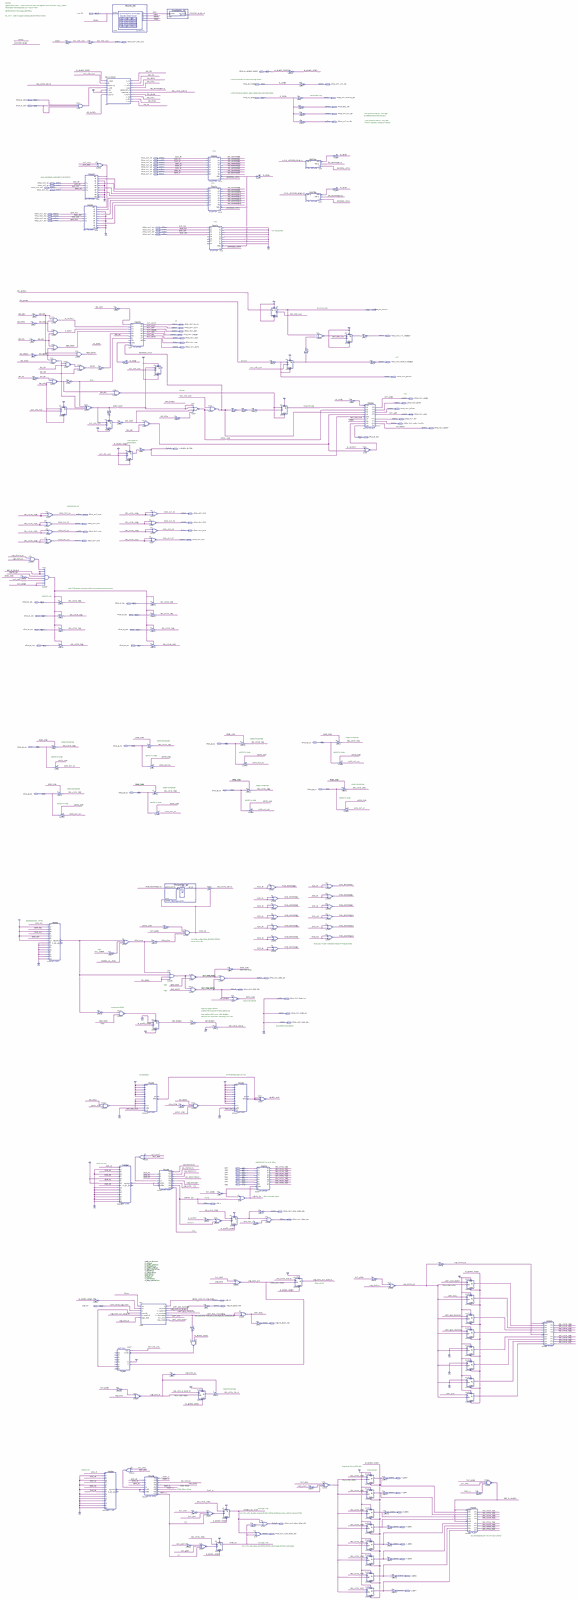
[diagram p0: schematic sheet, whole]
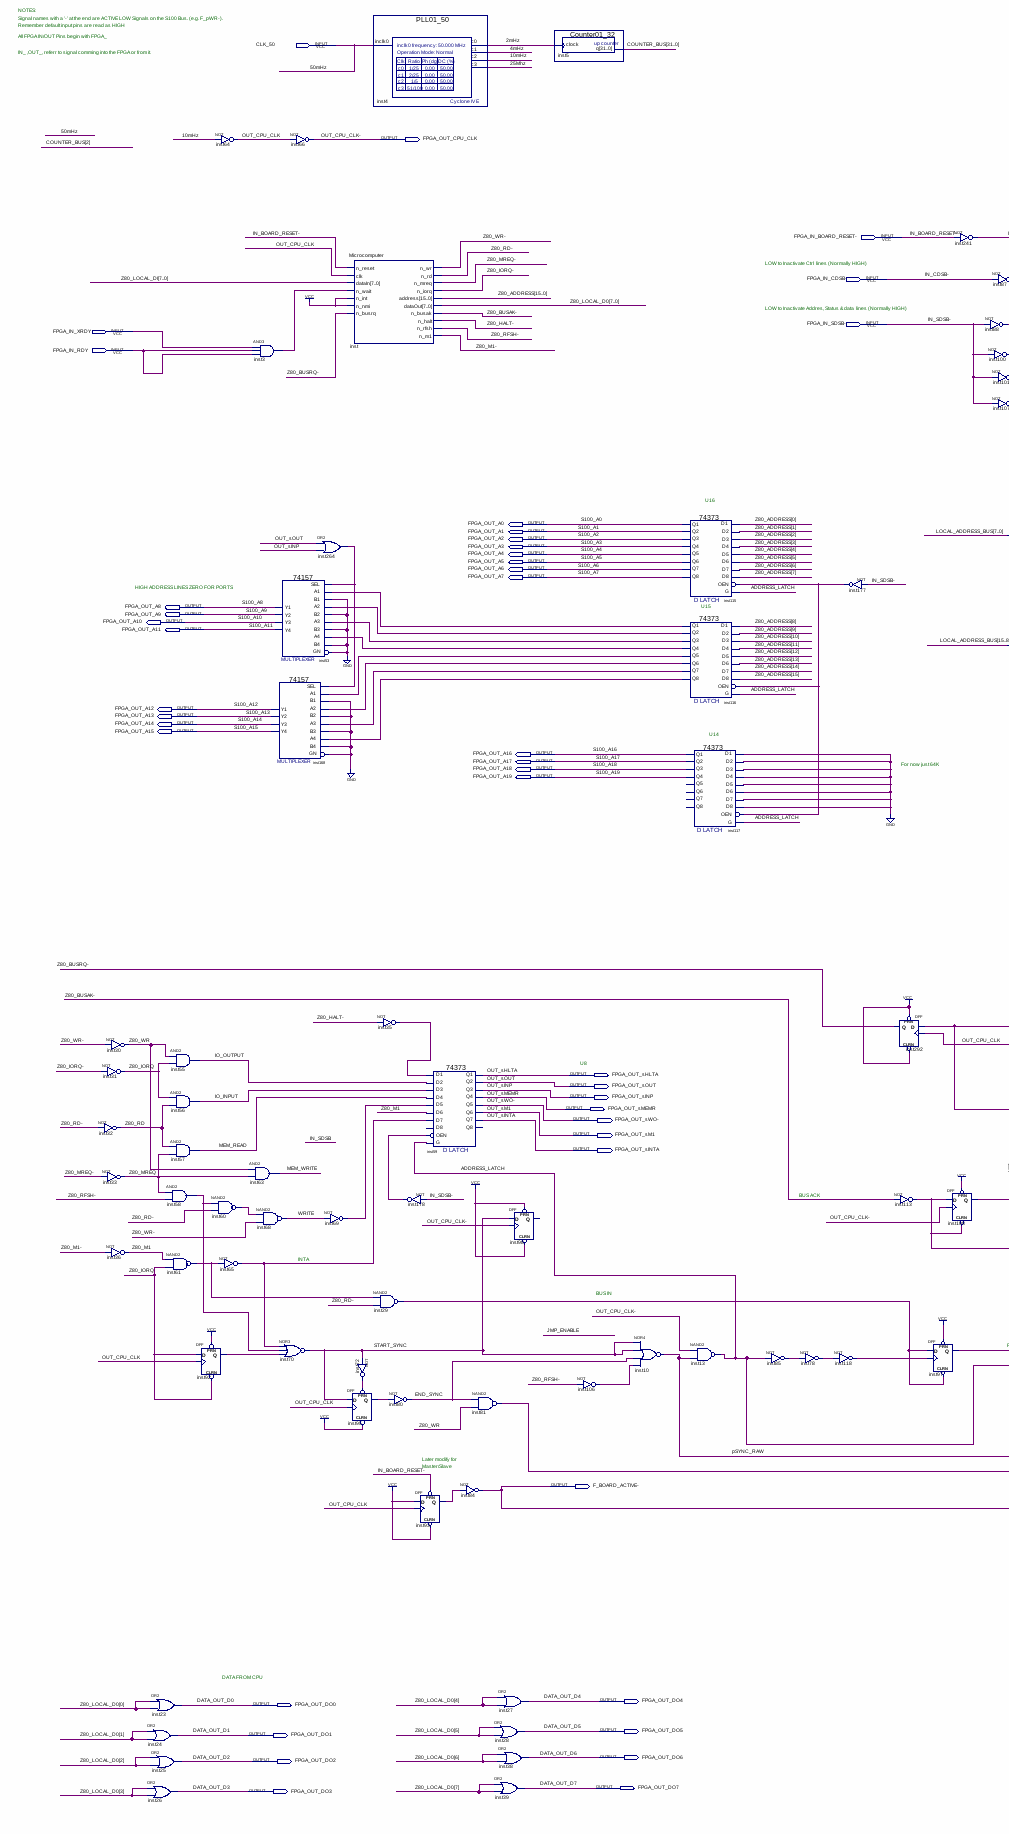
[diagram p1: schematic sheet, upper left part]
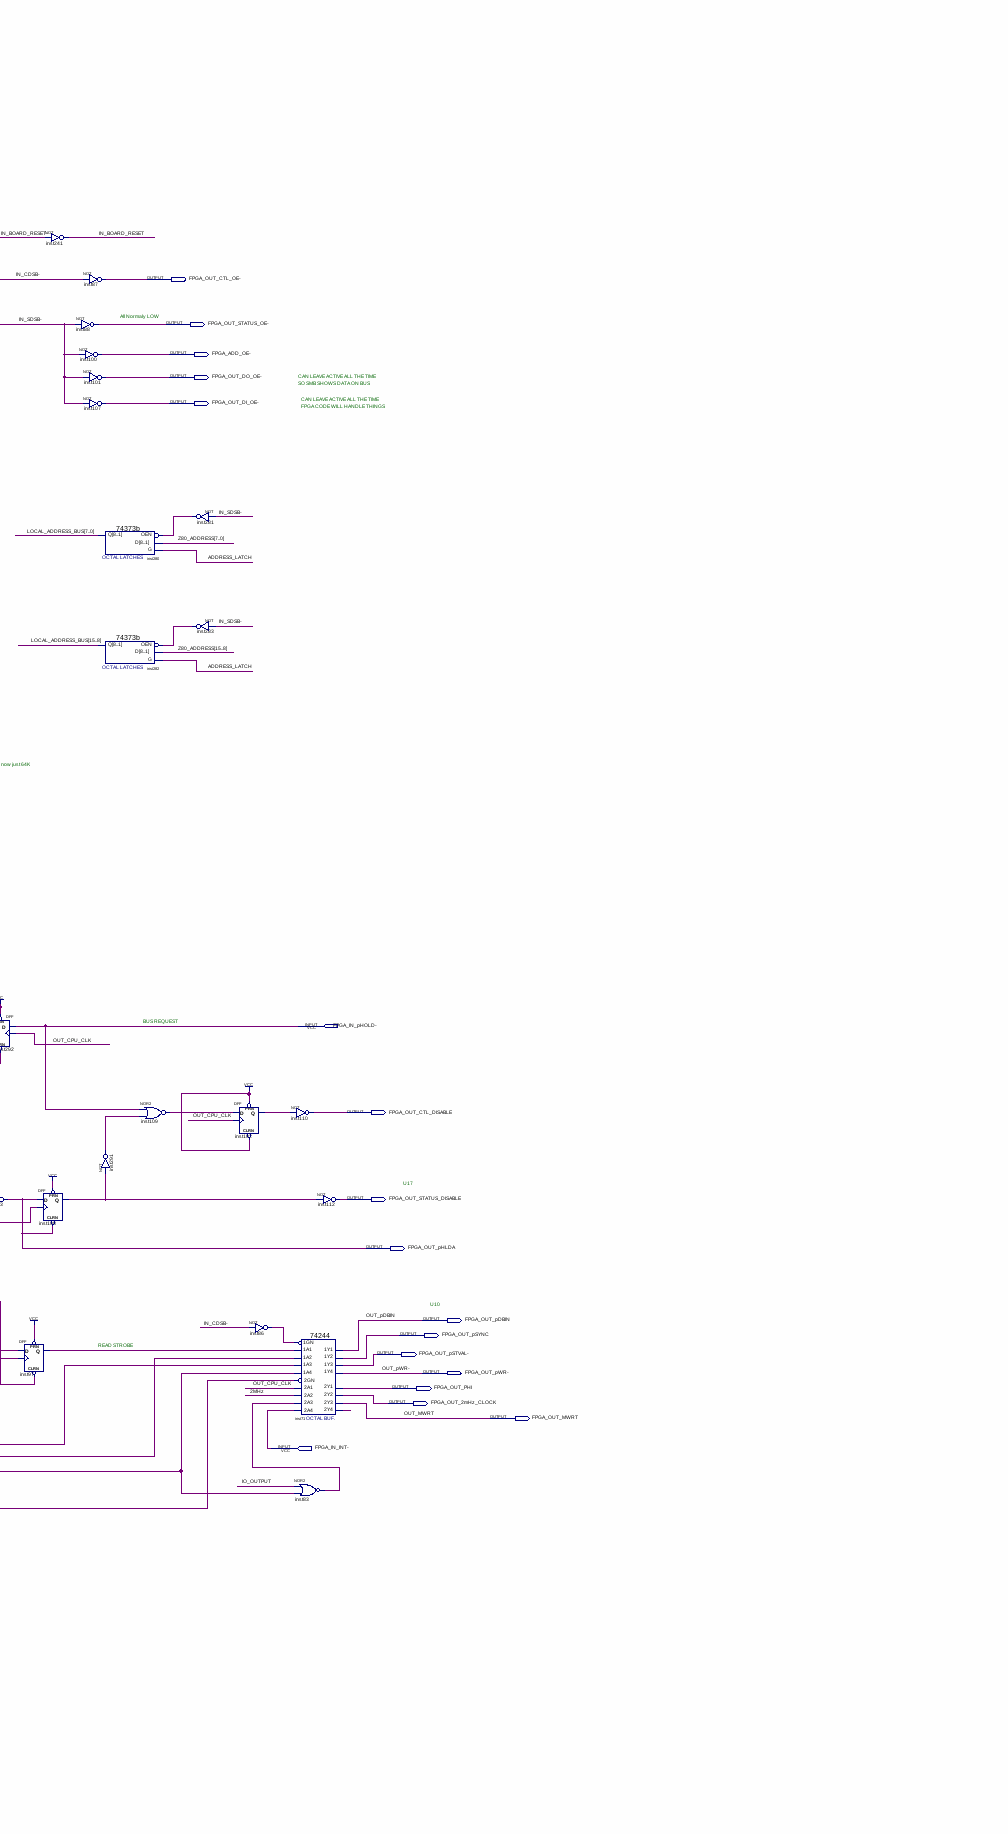
[diagram p2: schematic sheet, upper right part]
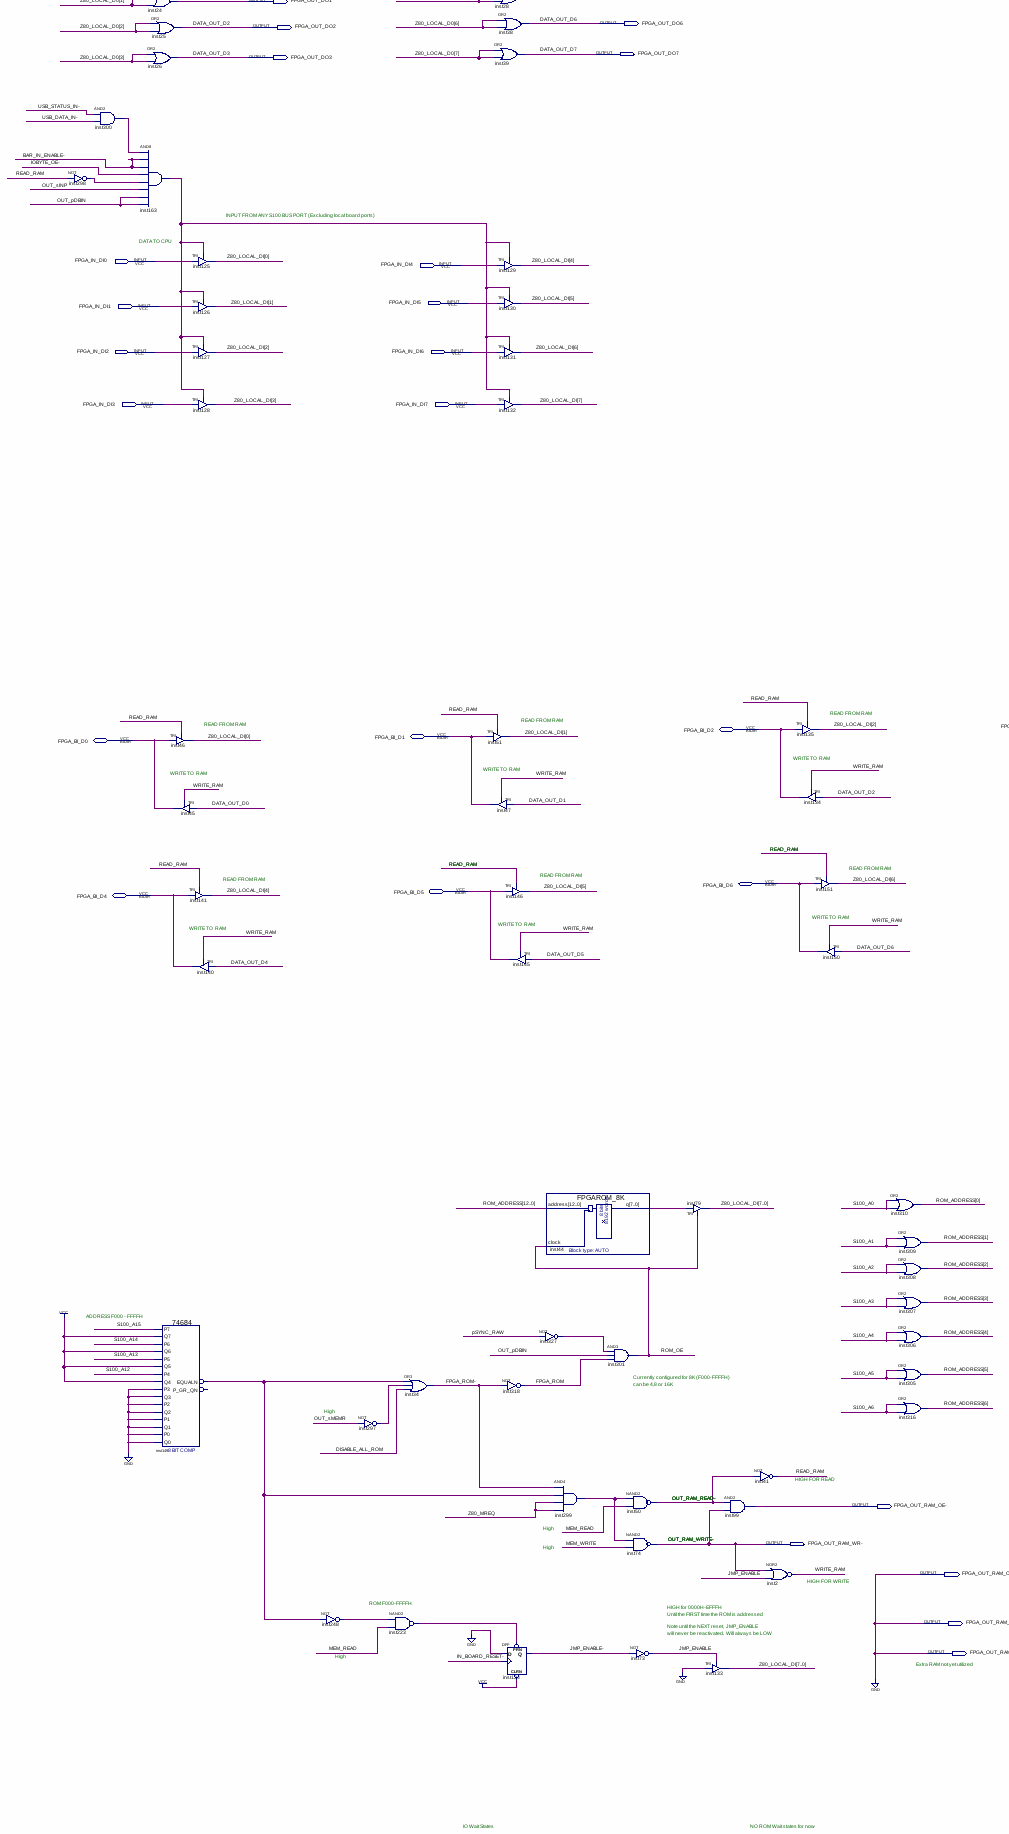
[diagram p3: schematic sheet, middle left part]
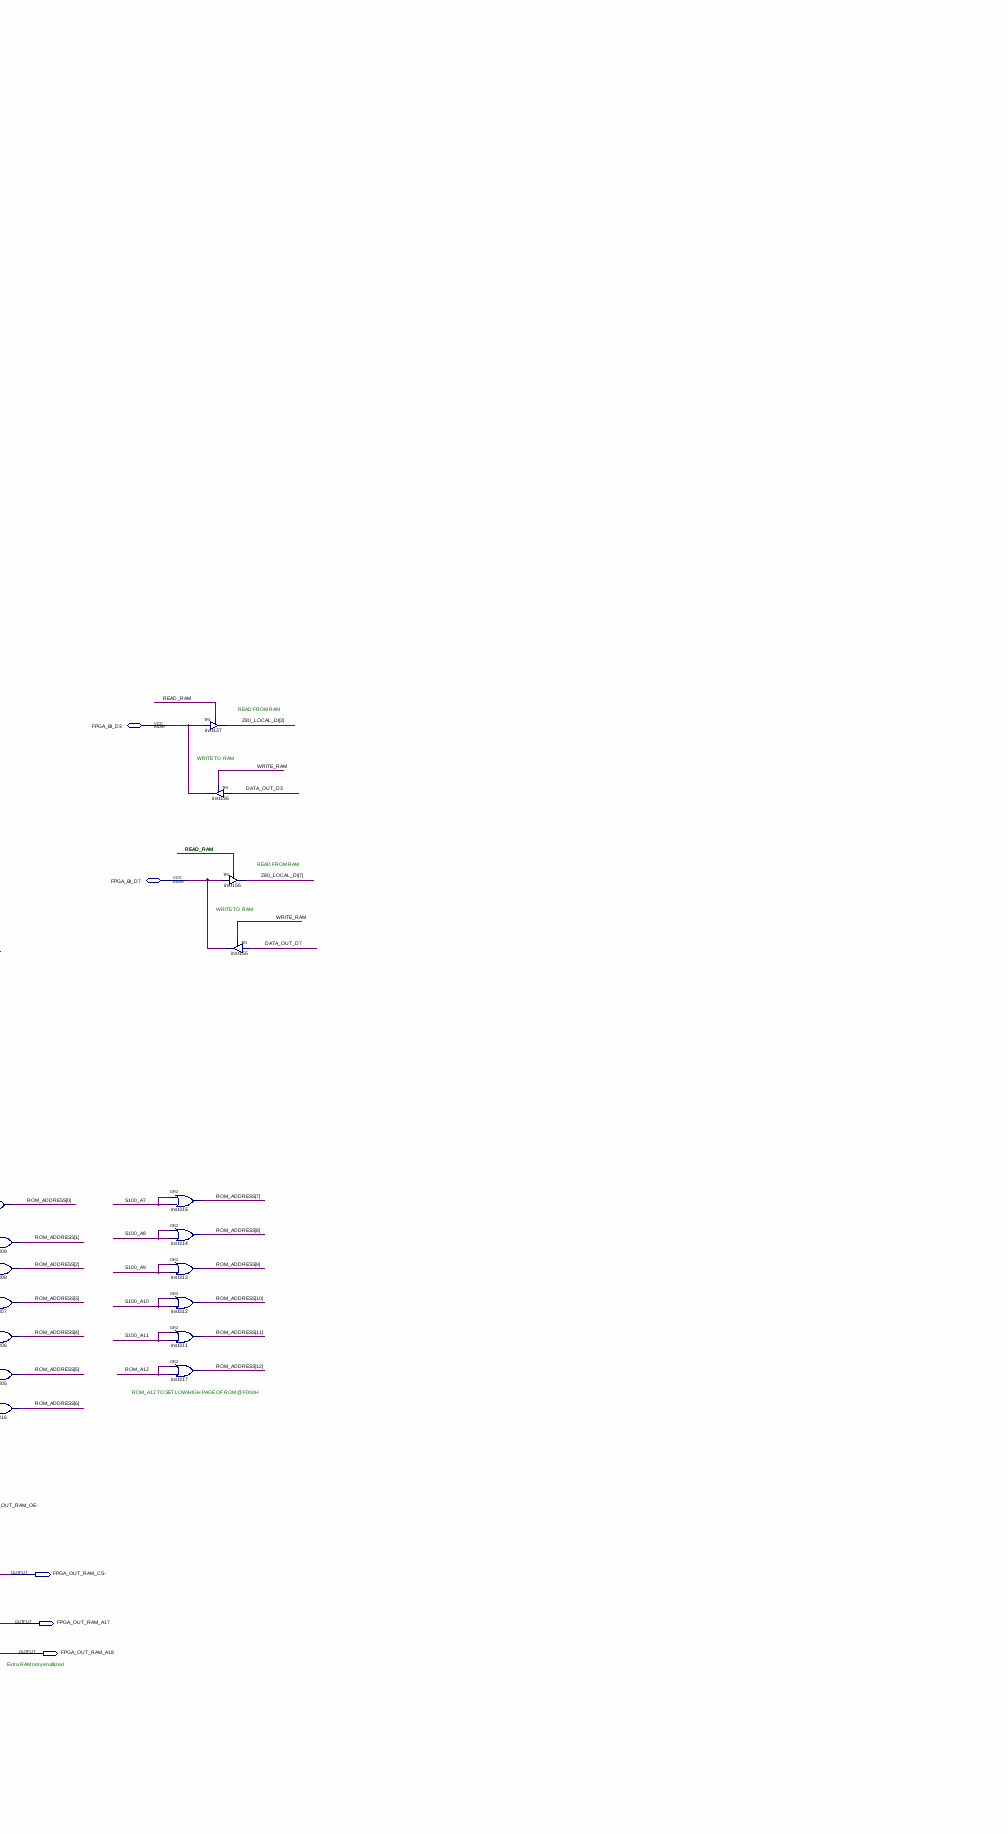
[diagram p4: schematic sheet, middle right part]
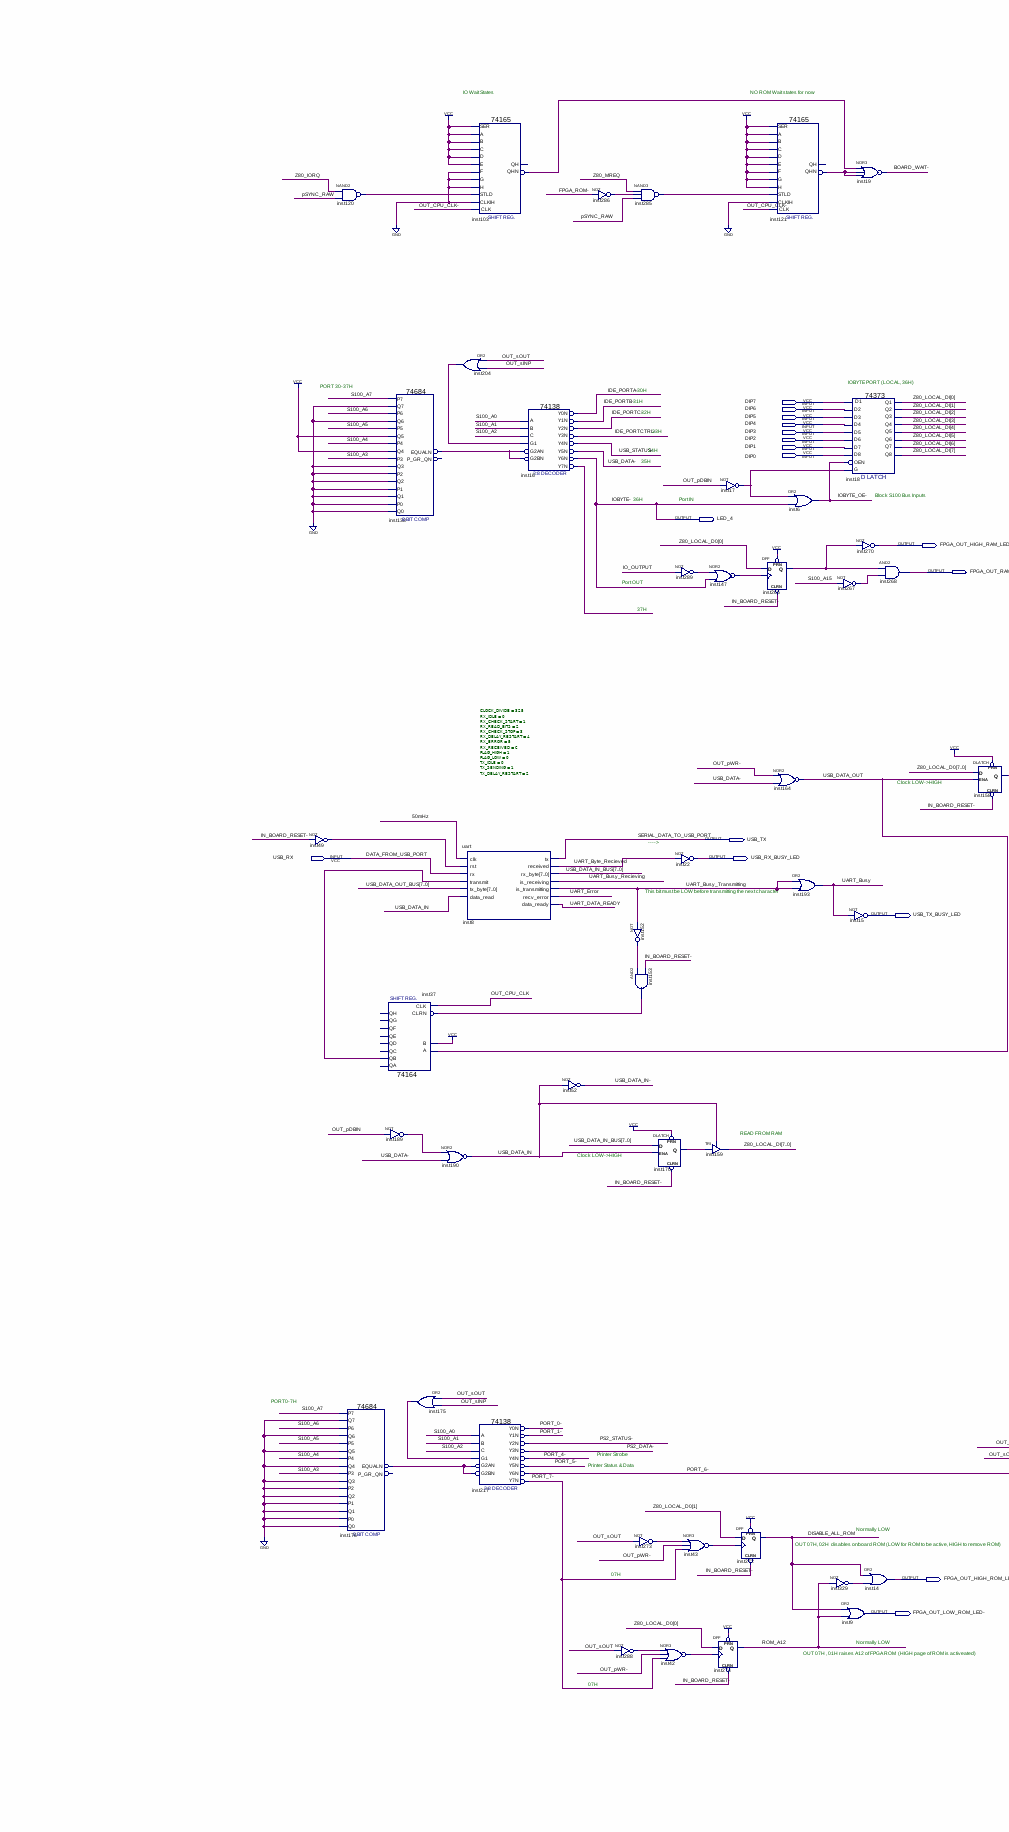
[diagram p5: schematic sheet, lower left part]
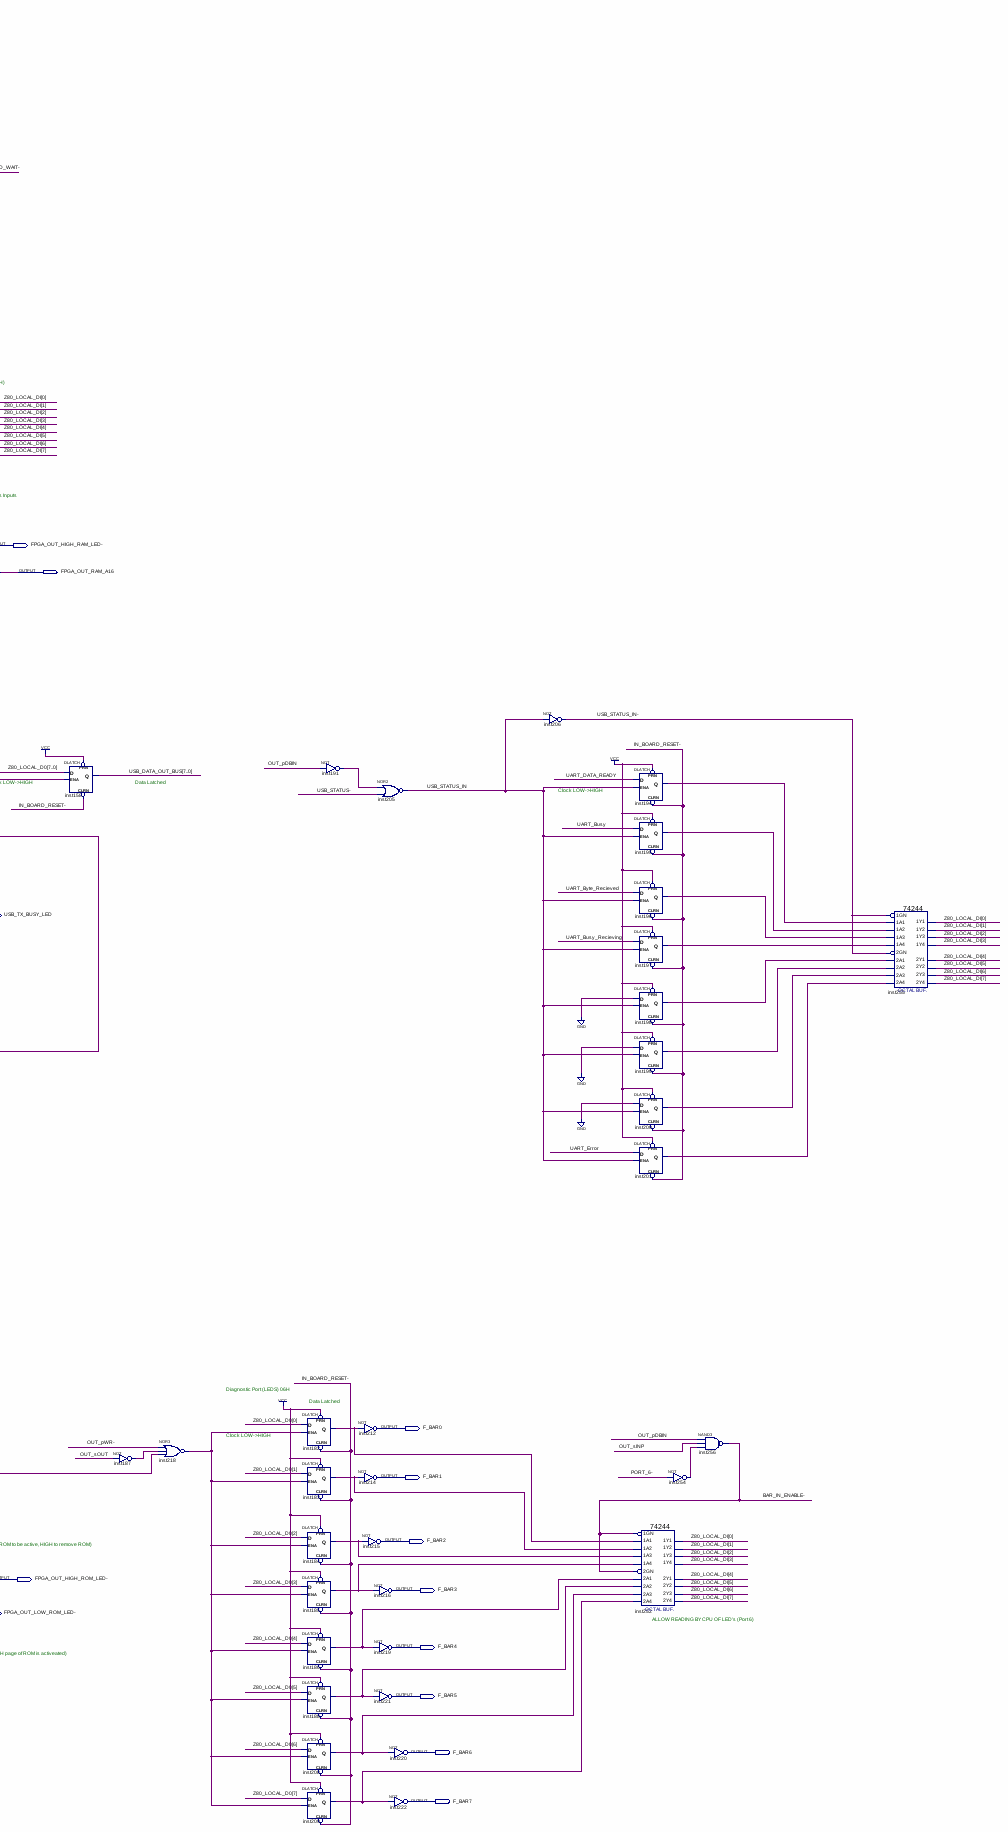
[diagram p6: schematic sheet, lower right part]
// Quartus schematic Z80_FPGA9 -- (Add HIGH-LOW ROM, LED Bar).bdf as structural Verilog: 214 symbols, 106 pins
module \Z80_FPGA9_--_(Add_HIGH-LOW_ROM,_LED_Bar)  (
  input  CLK_50,
  input  \FPGA_IN_BOARD_RESET- ,
  input  \FPGA_IN_CDSB- ,
  input  \FPGA_IN_SDSB- ,
  input  FPGA_IN_XRDY,
  input  FPGA_IN_RDY,
  input  \FPGA_IN_pHOLD- ,
  input  \FPGA_IN_INT- ,
  input  FPGA_IN_DI0,
  input  FPGA_IN_DI4,
  input  FPGA_IN_DI5,
  input  FPGA_IN_DI1,
  input  FPGA_IN_DI2,
  input  FPGA_IN_DI6,
  input  FPGA_IN_DI3,
  input  FPGA_IN_DI7,
  input  DIP7,
  input  DIP6,
  input  DIP5,
  input  DIP4,
  input  DIP3,
  input  DIP2,
  input  DIP1,
  input  DIP0,
  input  USB_RX,
  inout  FPGA_BI_D3,
  inout  FPGA_BI_D2,
  inout  FPGA_BI_D1,
  inout  FPGA_BI_D0,
  inout  FPGA_BI_D7,
  inout  FPGA_BI_D6,
  inout  FPGA_BI_D5,
  inout  FPGA_BI_D4,
  output FPGA_OUT_CPU_CLK,
  output \FPGA_OUT_CTL_OE- ,
  output \FPGA_OUT_STATUS_OE- ,
  output \FPGA_ADD_OE- ,
  output \FPGA_OUT_DO_OE- ,
  output \FPGA_OUT_DI_OE- ,
  output FPGA_OUT_A0,
  output FPGA_OUT_A1,
  output FPGA_OUT_A2,
  output FPGA_OUT_A3,
  output FPGA_OUT_A4,
  output FPGA_OUT_A5,
  output FPGA_OUT_A6,
  output FPGA_OUT_A7,
  output FPGA_OUT_A8,
  output FPGA_OUT_A9,
  output FPGA_OUT_A10,
  output FPGA_OUT_A11,
  output FPGA_OUT_A12,
  output FPGA_OUT_A13,
  output FPGA_OUT_A14,
  output FPGA_OUT_A15,
  output FPGA_OUT_A16,
  output FPGA_OUT_A17,
  output FPGA_OUT_A18,
  output FPGA_OUT_A19,
  output FPGA_OUT_sHLTA,
  output FPGA_OUT_sOUT,
  output FPGA_OUT_sINP,
  output FPGA_OUT_sMEMR,
  output FPGA_OUT_CTL_DISABLE,
  output \FPGA_OUT_sWO- ,
  output FPGA_OUT_sM1,
  output FPGA_OUT_sINTA,
  output FPGA_OUT_STATUS_DISABLE,
  output FPGA_OUT_pHLDA,
  output FPGA_OUT_pDBIN,
  output FPGA_OUT_pSYNC,
  output \FPGA_OUT_pSTVAL- ,
  output \FPGA_OUT_pWR- ,
  output FPGA_OUT_PHI,
  output FPGA_OUT_2mHz_CLOCK,
  output FPGA_OUT_MWRT,
  output \F_BOARD_ACTIVE- ,
  output FPGA_OUT_DO4,
  output FPGA_OUT_DO0,
  output FPGA_OUT_DO5,
  output FPGA_OUT_DO1,
  output FPGA_OUT_DO6,
  output FPGA_OUT_DO2,
  output FPGA_OUT_DO7,
  output FPGA_OUT_DO3,
  output \FPGA_OUT_RAM_OE- ,
  output \FPGA_OUT_RAM_WR- ,
  output \FPGA_OUT_RAM_CS- ,
  output FPGA_OUT_RAM_A17,
  output FPGA_OUT_RAM_A18,
  output LED_4,
  output \FPGA_OUT_HIGH_RAM_LED- ,
  output FPGA_OUT_RAM_A16,
  output USB_TX,
  output USB_RX_BUSY_LED,
  output USB_TX_BUSY_LED,
  output F_BAR0,
  output F_BAR1,
  output F_BAR2,
  output \FPGA_OUT_HIGH_ROM_LED- ,
  output F_BAR3,
  output \FPGA_OUT_LOW_ROM_LED- ,
  output F_BAR4,
  output F_BAR5,
  output F_BAR6,
  output F_BAR7
);

  wire \2mHz , \4mHz , \10mHz , \25Mhz , ADDRESS_LATCH, \BAR_IN_ENABLE- , \BOARD_WAIT- , DISABLE_ALL_ROM,
       END_SYNC, FPGA_ROM, \FPGA_ROM- , \IDE_PORTA- , \IDE_PORTB- , \IDE_PORTC- , \IDE_PORTCTRL- ,
       IN_BOARD_RESET, inst3_out, inst16_y7n, inst17_out, inst29_out, inst35_out, inst37_qb, inst42_out,
       inst43_out, inst49_out, inst58_out, inst60_out, inst61_out, inst65_out, inst69_out, inst71_2y4,
       inst72_out, inst78_out, inst81_out, inst83_out, inst85_out, inst86_out, inst92_q, inst93_q, inst95_q,
       inst97_q, inst102_q, inst103_qhn, inst106_out, inst108_q, inst109_out, inst116_q1, inst116_q2,
       inst116_q3, inst116_q4, inst116_q5, inst116_q6, inst116_q7, inst116_q8, inst118_out, inst120_out,
       inst121_qhn, inst138_equaln, inst147_out, inst149_equaln, inst152_out, inst153_out, inst163_out,
       inst175_out, inst176_equaln, inst177_out, inst178_out, inst182_q, inst183_q, inst184_q, inst185_q,
       inst186_q, inst187_out, inst188_q, inst189_out, inst191_out, inst194_q, inst195_q, inst196_q,
       inst197_q, inst198_q, inst199_q, inst200_q, inst201_q, inst204_out, inst208_q, inst209_q, inst218_out,
       inst223_out, inst248_out, inst254_out, inst264_out, inst266_q, inst267_out, inst273_out, inst281_out,
       inst283_out, inst285_out, inst286_out, inst288_out, inst289_out, inst291_out, inst297_out,
       inst298_out, inst299_out, inst300_out, inst327_out, inst329_out, IO_INPUT, IO_OUTPUT, \IOBYTE_OE- ,
       JMP_ENABLE, \JMP_ENABLE- , MEM_READ, MEM_WRITE, OUT_CPU_CLK, \OUT_RAM_READ- , \PORT_0- , \PORT_1- ,
       \PORT_4- , \PORT_5- , \PORT_6- , \PORT_7- , \PS2_DATA- , \PS2_STATUS- , pSYNC_RAW, READ_RAM, ROM_A12,
       ROM_OE, START_SYNC, UART_Busy, UART_Busy_Recieving, UART_Busy_Transmitting, UART_Byte_Recieved,
       UART_DATA_READY, UART_Error, \USB_DATA- , USB_DATA_IN, \USB_DATA_IN- , USB_DATA_OUT, \USB_STATUS- ,
       USB_STATUS_IN, \USB_STATUS_IN- , WRITE, WRITE_RAM, \Z80_BUSAK- , \Z80_BUSRQ- , \Z80_HALT- , Z80_IORQ,
       \Z80_IORQ- , Z80_M1, \Z80_M1- , Z80_MREQ, \Z80_MREQ- , Z80_RD, \Z80_RD- , \Z80_RFSH- , Z80_WR,
       \Z80_WR- ;
  wire [7:0] inst44_q, inst170_q, USB_DATA_IN_BUS, USB_DATA_OUT_BUS, Z80_LOCAL_D0, Z80_LOCAL_DI;
  wire [12:0] ROM_ADDRESS;
  wire [15:0] LOCAL_ADDRESS_BUS, Z80_ADDRESS;
  wire [31:0] COUNTER_BUS;

  not inst298 (inst298_out, READ_RAM);
  not inst32 (Z80_RD, \Z80_RD- );
  and inst300 (inst300_out, \USB_STATUS_IN- , \USB_DATA_IN- );
  not inst30 (Z80_WR, \Z80_WR- );
  not inst31 (Z80_IORQ, \Z80_IORQ- );
  not inst33 (Z80_MREQ, \Z80_MREQ- );
  not inst36 (Z80_M1, \Z80_M1- );
  or inst23 (FPGA_OUT_DO0, Z80_LOCAL_D0[0], Z80_LOCAL_D0[0]);
  or inst24 (FPGA_OUT_DO1, Z80_LOCAL_D0[1], Z80_LOCAL_D0[1]);
  or inst25 (FPGA_OUT_DO2, Z80_LOCAL_D0[2], Z80_LOCAL_D0[2]);
  or inst26 (FPGA_OUT_DO3, Z80_LOCAL_D0[3], Z80_LOCAL_D0[3]);
  and inst163 (inst163_out, inst300_out, \BAR_IN_ENABLE- , \BAR_IN_ENABLE- , \IOBYTE_OE- , inst298_out, FPGA_OUT_sINP, FPGA_OUT_pDBIN, FPGA_OUT_pDBIN);
  \74684  inst149 (
    .P2(1'b0), .Q2(1'b0), .P1(1'b0), .Q1(1'b0), .P0(1'b0), .Q0(1'b0), .P7(FPGA_OUT_A15), .Q7(1'b1),
    .Q6(1'b1), .P6(FPGA_OUT_A14), .Q5(1'b1), .P5(FPGA_OUT_A13), .P4(FPGA_OUT_A12), .Q4(1'b1), .Q3(1'b0),
    .P3(1'b0), .EQUALN(inst149_equaln));  // open: P_GR_QN
  and inst55 (IO_OUTPUT, Z80_WR, Z80_IORQ);
  and inst56 (IO_INPUT, Z80_IORQ, Z80_RD);
  and inst57 (MEM_READ, Z80_RD, Z80_MREQ);
  and inst58 (inst58_out, Z80_MREQ, \Z80_RFSH- );
  nand inst61 (inst61_out, Z80_M1, Z80_IORQ);
  TRI inst46 (.IN(FPGA_BI_D0), .OE(READ_RAM), .OUT(Z80_LOCAL_DI[0]));
  TRI inst45 (.IN(FPGA_OUT_DO0), .OE(WRITE_RAM), .OUT(FPGA_BI_D0));
  TRI inst141 (.IN(FPGA_BI_D4), .OE(READ_RAM), .OUT(Z80_LOCAL_DI[4]));
  not inst64 (OUT_CPU_CLK, \10mHz );
  nand inst60 (inst60_out, inst58_out, \Z80_RD- );
  not inst65 (inst65_out, inst61_out);
  DFF inst92 (.CLRN(Z80_IORQ), .CLK(OUT_CPU_CLK), .D(Z80_IORQ), .PRN(1'b1), .Q(inst92_q));
  TRI inst125 (.IN(FPGA_IN_DI0), .OE(inst163_out), .OUT(Z80_LOCAL_DI[0]));
  TRI inst126 (.IN(FPGA_IN_DI1), .OE(inst163_out), .OUT(Z80_LOCAL_DI[1]));
  TRI inst127 (.IN(FPGA_IN_DI2), .OE(inst163_out), .OUT(Z80_LOCAL_DI[2]));
  TRI inst128 (.IN(FPGA_IN_DI3), .OE(inst163_out), .OUT(Z80_LOCAL_DI[3]));
  TRI inst140 (.IN(FPGA_OUT_DO4), .OE(WRITE_RAM), .OUT(FPGA_BI_D4));
  and inst63 (MEM_WRITE, Z80_WR, Z80_MREQ);
  and inst3 (inst3_out, FPGA_IN_XRDY, FPGA_IN_RDY, FPGA_IN_RDY);
  \74157  inst53 (
    .A1(inst116_q1), .B1(1'b0), .SEL(inst264_out), .B2(1'b0), .A3(inst116_q3), .B3(1'b0), .A2(inst116_q2),
    .B4(1'b0), .GN(1'b0), .A4(inst116_q4), .Y2(FPGA_OUT_A9), .Y1(FPGA_OUT_A8), .Y4(FPGA_OUT_A11),
    .Y3(FPGA_OUT_A10));
  \74157  inst168 (
    .A1(inst116_q5), .B1(1'b0), .SEL(inst264_out), .B2(1'b0), .A3(inst116_q7), .B3(1'b0), .A2(inst116_q6),
    .B4(1'b0), .GN(1'b0), .A4(inst116_q8), .Y2(FPGA_OUT_A13), .Y1(FPGA_OUT_A12), .Y4(FPGA_OUT_A15),
    .Y3(FPGA_OUT_A14));
  nand inst68 (WRITE, inst60_out, \Z80_WR- );
  nor inst70 (START_SYNC, inst65_out, inst58_out, inst92_q);
  not inst66 (FPGA_OUT_CPU_CLK, OUT_CPU_CLK);
  not inst49 (inst49_out, \FPGA_IN_BOARD_RESET- );
  or inst264 (inst264_out, FPGA_OUT_sOUT, FPGA_OUT_sINP);
  not inst69 (inst69_out, WRITE);
  not inst248 (inst248_out, inst149_equaln);
  nand inst120 (inst120_out, Z80_IORQ, pSYNC_RAW);
  \74684  inst176 (
    .P2(1'b0), .Q2(1'b0), .P1(1'b0), .Q1(1'b0), .P0(1'b0), .Q0(1'b0), .P7(FPGA_OUT_A7), .Q7(1'b0), .Q6(1'b0),
    .P6(FPGA_OUT_A6), .Q5(1'b0), .P5(FPGA_OUT_A5), .P4(FPGA_OUT_A4), .Q4(1'b0), .Q3(1'b0), .P3(FPGA_OUT_A3),
    .EQUALN(inst176_equaln));  // open: P_GR_QN
  Microcomputer inst (
    .n_reset(\FPGA_IN_BOARD_RESET- ), .clk(OUT_CPU_CLK), .dataIn(Z80_LOCAL_DI), .n_wait(inst3_out),
    .n_int(1'b1), .n_nmi(1'b1), .n_busrq(\Z80_BUSRQ- ), .n_wr(\Z80_WR- ), .n_rd(\Z80_RD- ),
    .n_mreq(\Z80_MREQ- ), .n_iorq(\Z80_IORQ- ), .address(Z80_ADDRESS), .dataOut(Z80_LOCAL_D0),
    .n_busak(\Z80_BUSAK- ), .n_halt(\Z80_HALT- ), .n_rfsh(\Z80_RFSH- ), .n_m1(\Z80_M1- ));
  not inst72 (inst72_out, START_SYNC);
  DFF inst95 (.CLRN(1'b1), .CLK(OUT_CPU_CLK), .D(START_SYNC), .PRN(inst72_out), .Q(inst95_q));
  not inst297 (inst297_out, FPGA_OUT_sMEMR);
  PLL01_50 inst4 (.inclk0(CLK_50), .c0(\2mHz ), .c1(\4mHz ), .c2(\10mHz ), .c3(\25Mhz ));
  not inst35 (inst35_out, \Z80_HALT- );
  nand inst29 (inst29_out, inst61_out, \Z80_RD- );
  not inst80 (END_SYNC, inst95_q);
  nand inst223 (inst223_out, inst248_out, MEM_READ);
  \74684  inst138 (
    .P2(1'b0), .Q2(1'b0), .P1(1'b0), .Q1(1'b0), .P0(1'b0), .Q0(1'b0), .P7(FPGA_OUT_A7), .Q7(1'b0), .Q6(1'b0),
    .P6(FPGA_OUT_A6), .Q5(1'b1), .P5(FPGA_OUT_A5), .P4(FPGA_OUT_A4), .Q4(1'b1), .Q3(1'b0), .P3(FPGA_OUT_A3),
    .EQUALN(inst138_equaln));  // open: P_GR_QN
  \74164  inst37 (
    .CLRN(inst153_out), .CLK(OUT_CPU_CLK), .B(1'b1), .A(USB_DATA_OUT), .QB(inst37_qb));  // open: QD, QC, QA, QF, QH, QG, QE
  not inst189 (inst189_out, FPGA_OUT_pDBIN);
  \74373  inst59 (
    .D1(inst35_out), .D3(IO_INPUT), .D6(Z80_M1), .D7(inst65_out), .D2(IO_OUTPUT), .G(ADDRESS_LATCH),
    .D4(MEM_READ), .D5(inst69_out), .OEN(inst178_out), .Q3(FPGA_OUT_sINP), .Q6(FPGA_OUT_sM1),
    .Q7(FPGA_OUT_sINTA), .Q2(FPGA_OUT_sOUT), .Q4(FPGA_OUT_sMEMR), .Q5(\FPGA_OUT_sWO- ), .Q1(FPGA_OUT_sHLTA));  // open: D8, Q8
  not inst178 (inst178_out, \FPGA_IN_SDSB- );
  DFF inst93 (.CLRN(1'b1), .CLK(OUT_CPU_CLK), .D(1'b1), .PRN(\FPGA_IN_BOARD_RESET- ), .Q(inst93_q));
  or inst34 (\FPGA_ROM- , inst149_equaln, inst297_out, DISABLE_ALL_ROM);
  or inst175 (inst175_out, FPGA_OUT_sOUT, FPGA_OUT_sINP);
  not inst84 (\F_BOARD_ACTIVE- , inst93_q);
  or inst204 (inst204_out, FPGA_OUT_sOUT, FPGA_OUT_sINP);
  uart #(.CLOCK_DIVIDE(325), .RX_IDLE(0), .RX_CHECK_START(1), .RX_READ_BITS(2), .RX_CHECK_STOP(3), .RX_DELAY_RESTART(4), .RX_ERROR(5), .RX_RECEIVED(6), .FLAG_HIGH(1), .FLAG_LOW(0), .TX_IDLE(0), .TX_SENDING(1), .TX_DELAY_RESTART(2)) inst8 (
    .clk(CLK_50), .rst(inst49_out), .rx(USB_RX), .transmit(inst37_qb), .tx_byte(USB_DATA_OUT_BUS),
    .data_read(USB_DATA_IN), .tx(USB_TX), .received(UART_Byte_Recieved), .rx_byte(USB_DATA_IN_BUS),
    .is_receiving(UART_Busy_Recieving), .is_transmitting(UART_Busy_Transmitting), .recv_error(UART_Error),
    .data_ready(UART_DATA_READY));
  nor inst190 (USB_DATA_IN, inst189_out, \USB_DATA- );
  nand inst81 (inst81_out, END_SYNC, Z80_WR);
  TRI inst51 (.IN(FPGA_BI_D1), .OE(READ_RAM), .OUT(Z80_LOCAL_DI[1]));
  TRI inst47 (.IN(FPGA_OUT_DO1), .OE(WRITE_RAM), .OUT(FPGA_BI_D1));
  \74165  inst103 (
    .D(1'b1), .C(1'b1), .B(1'b1), .G(1'b0), .H(1'b0), .A(1'b1), .CLKIH(1'b0), .E(1'b1), .F(1'b0),
    .CLK(FPGA_OUT_CPU_CLK), .STLD(inst120_out), .SER(1'b1), .QHN(inst103_qhn));  // open: QH
  \74138  inst217 (
    .A(FPGA_OUT_A0), .B(FPGA_OUT_A1), .G1(inst175_out), .C(FPGA_OUT_A2), .G2AN(inst176_equaln),
    .G2BN(inst176_equaln), .Y0N(\PORT_0- ), .Y1N(\PORT_1- ), .Y2N(\PS2_STATUS- ), .Y3N(\PS2_DATA- ),
    .Y4N(\PORT_4- ), .Y5N(\PORT_5- ), .Y6N(\PORT_6- ), .Y7N(\PORT_7- ));
  DFF inst98 (.CLRN(1'b1), .CLK(FPGA_OUT_CPU_CLK), .D(START_SYNC), .PRN(1'b1));  // open: Q
  or inst27 (FPGA_OUT_DO4, Z80_LOCAL_D0[4], Z80_LOCAL_D0[4]);
  or inst28 (FPGA_OUT_DO5, Z80_LOCAL_D0[5], Z80_LOCAL_D0[5]);
  or inst38 (FPGA_OUT_DO6, Z80_LOCAL_D0[6], Z80_LOCAL_D0[6]);
  or inst39 (FPGA_OUT_DO7, Z80_LOCAL_D0[7], Z80_LOCAL_D0[7]);
  TRI inst129 (.IN(FPGA_IN_DI4), .OE(inst163_out), .OUT(Z80_LOCAL_DI[4]));
  TRI inst130 (.IN(FPGA_IN_DI5), .OE(inst163_out), .OUT(Z80_LOCAL_DI[5]));
  TRI inst131 (.IN(FPGA_IN_DI6), .OE(inst163_out), .OUT(Z80_LOCAL_DI[6]));
  TRI inst132 (.IN(FPGA_IN_DI7), .OE(inst163_out), .OUT(Z80_LOCAL_DI[7]));
  TRI inst146 (.IN(FPGA_BI_D5), .OE(READ_RAM), .OUT(Z80_LOCAL_DI[5]));
  TRI inst145 (.IN(FPGA_OUT_DO5), .OE(WRITE_RAM), .OUT(FPGA_BI_D5));
  not inst318 (FPGA_ROM, \FPGA_ROM- );
  DFF inst124 (.CLRN(1'b1), .CLK(\FPGA_IN_BOARD_RESET- ), .D(1'b0), .PRN(inst223_out), .Q(\JMP_ENABLE- ));
  \74138  inst16 (
    .A(FPGA_OUT_A0), .B(FPGA_OUT_A1), .G1(inst204_out), .C(FPGA_OUT_A2), .G2AN(inst138_equaln),
    .G2BN(inst138_equaln), .Y0N(\IDE_PORTA- ), .Y1N(\IDE_PORTB- ), .Y2N(\IDE_PORTC- ), .Y3N(\IDE_PORTCTRL- ),
    .Y4N(\USB_STATUS- ), .Y5N(\USB_DATA- ), .Y6N(LED_4), .Y7N(inst16_y7n));
  FPGAROM_8K inst44 (.address(ROM_ADDRESS), .clock(ROM_OE), .q(inst44_q));
  not inst327 (inst327_out, pSYNC_RAW);
  Counter01_32 inst5 (.clock(\2mHz ), .q(COUNTER_BUS));
  not inst106 (inst106_out, \Z80_RFSH- );
  and inst299 (inst299_out, \FPGA_ROM- , inst149_equaln, Z80_MREQ, Z80_MREQ);
  not inst52 (\USB_DATA_IN- , USB_DATA_IN);
  and inst301 (ROM_OE, inst327_out, FPGA_OUT_pDBIN, FPGA_ROM);
  not inst286 (inst286_out, \FPGA_ROM- );
  nor inst10 (pSYNC_RAW, START_SYNC, START_SYNC, END_SYNC, inst106_out);
  nand inst50 (\OUT_RAM_READ- , inst299_out, MEM_READ);
  nand inst74 (\FPGA_OUT_RAM_WR- , inst299_out, MEM_WRITE);
  not inst73 (JMP_ENABLE, \JMP_ENABLE- );
  nand inst285 (inst285_out, Z80_MREQ, inst286_out, pSYNC_RAW);
  not inst152 (inst152_out, UART_Busy_Transmitting);
  and inst153 (inst153_out, inst152_out, \FPGA_IN_BOARD_RESET- );
  not inst273 (inst273_out, FPGA_OUT_sOUT);
  not inst288 (inst288_out, FPGA_OUT_sOUT);
  DLATCH inst170[7:0] (
    .CLRN(\FPGA_IN_BOARD_RESET- ), .D(USB_DATA_IN_BUS), .ENA(USB_DATA_IN), .PRN(1'b1), .Q(inst170_q));
  nor inst42 (inst42_out, inst288_out, \FPGA_OUT_pWR- , \PORT_7- );
  \74373  inst115 (
    .D1(Z80_ADDRESS[0]), .D3(Z80_ADDRESS[2]), .D6(Z80_ADDRESS[5]), .D7(Z80_ADDRESS[6]), .D2(Z80_ADDRESS[1]),
    .G(ADDRESS_LATCH), .D4(Z80_ADDRESS[3]), .D5(Z80_ADDRESS[4]), .D8(Z80_ADDRESS[7]), .OEN(inst177_out),
    .Q3(FPGA_OUT_A2), .Q6(FPGA_OUT_A5), .Q7(FPGA_OUT_A6), .Q2(FPGA_OUT_A1), .Q8(FPGA_OUT_A7),
    .Q4(FPGA_OUT_A3), .Q5(FPGA_OUT_A4), .Q1(FPGA_OUT_A0));
  \74373  inst116 (
    .D1(Z80_ADDRESS[8]), .D3(Z80_ADDRESS[10]), .D6(Z80_ADDRESS[13]), .D7(Z80_ADDRESS[14]),
    .D2(Z80_ADDRESS[9]), .G(ADDRESS_LATCH), .D4(Z80_ADDRESS[11]), .D5(Z80_ADDRESS[12]), .D8(Z80_ADDRESS[15]),
    .OEN(inst177_out), .Q3(inst116_q3), .Q6(inst116_q6), .Q7(inst116_q7), .Q2(inst116_q2), .Q8(inst116_q8),
    .Q4(inst116_q4), .Q5(inst116_q5), .Q1(inst116_q1));
  \74373  inst117 (
    .D1(1'b0), .D3(1'b0), .D6(1'b0), .D7(1'b0), .D2(1'b0), .G(ADDRESS_LATCH), .D4(1'b0), .D5(1'b0),
    .D8(1'b0), .OEN(inst177_out), .Q3(FPGA_OUT_A18), .Q2(FPGA_OUT_A17), .Q4(FPGA_OUT_A19), .Q1(FPGA_OUT_A16));  // open: Q6, Q7, Q8, Q5
  nand inst13 (ADDRESS_LATCH, FPGA_OUT_CPU_CLK, pSYNC_RAW);
  TRI inst79[7:0] (.IN(inst44_q), .OE(ROM_OE), .OUT(Z80_LOCAL_DI));
  not inst289 (inst289_out, IO_OUTPUT);
  not inst22 (USB_RX_BUSY_LED, UART_Byte_Recieved);
  nor inst43 (inst43_out, inst273_out, \FPGA_OUT_pWR- , \PORT_7- );
  and inst99 (\FPGA_OUT_RAM_OE- , \OUT_RAM_READ- , \FPGA_OUT_RAM_WR- );
  TRI inst133[7:0] (.IN(1'b0), .OE(JMP_ENABLE), .OUT(Z80_LOCAL_DI));
  not inst17 (inst17_out, FPGA_OUT_pDBIN);
  nor inst147 (inst147_out, inst289_out, LED_4);
  TRI inst159[7:0] (.IN(inst170_q), .OE(USB_DATA_IN), .OUT(Z80_LOCAL_DI));
  DFF inst274 (.CLRN(\FPGA_IN_BOARD_RESET- ), .CLK(inst42_out), .D(Z80_LOCAL_D0[0]), .PRN(1'b1), .Q(ROM_A12));
  not inst41 (READ_RAM, \OUT_RAM_READ- );
  DFF inst266 (.CLRN(\FPGA_IN_BOARD_RESET- ), .CLK(inst147_out), .D(Z80_LOCAL_D0[0]), .PRN(1'b1), .Q(inst266_q));
  DFF inst272 (.CLRN(\FPGA_IN_BOARD_RESET- ), .CLK(inst43_out), .D(Z80_LOCAL_D0[1]), .PRN(1'b1), .Q(DISABLE_ALL_ROM));
  not inst85 (inst85_out, ADDRESS_LATCH);
  nor inst2 (WRITE_RAM, \FPGA_OUT_RAM_WR- , JMP_ENABLE);
  \74165  inst121 (
    .D(1'b1), .C(1'b1), .B(1'b1), .G(1'b1), .H(1'b1), .A(1'b1), .CLKIH(1'b0), .E(1'b1), .F(1'b1),
    .CLK(FPGA_OUT_CPU_CLK), .STLD(inst285_out), .SER(1'b1), .QHN(inst121_qhn));  // open: QH
  or inst6 (\IOBYTE_OE- , inst17_out, LED_4);
  nor inst164 (USB_DATA_OUT, \FPGA_OUT_pWR- , \USB_DATA- );
  or inst193 (UART_Busy, UART_Busy_Transmitting, UART_Busy_Transmitting);
  not inst78 (inst78_out, inst85_out);
  TRI inst135 (.IN(FPGA_BI_D2), .OE(READ_RAM), .OUT(Z80_LOCAL_DI[2]));
  TRI inst134 (.IN(FPGA_OUT_DO2), .OE(WRITE_RAM), .OUT(FPGA_BI_D2));
  TRI inst151 (.IN(FPGA_BI_D6), .OE(READ_RAM), .OUT(Z80_LOCAL_DI[6]));
  TRI inst150 (.IN(FPGA_OUT_DO6), .OE(WRITE_RAM), .OUT(FPGA_BI_D6));
  not inst177 (inst177_out, \FPGA_IN_SDSB- );
  not inst118 (inst118_out, inst78_out);
  \74373  inst18 (
    .D1(DIP7), .D3(DIP5), .D6(DIP2), .D7(DIP1), .D2(DIP6), .G(inst17_out), .D4(DIP4), .D5(DIP3), .D8(DIP0),
    .OEN(\IOBYTE_OE- ), .Q3(Z80_LOCAL_DI[2]), .Q6(Z80_LOCAL_DI[5]), .Q7(Z80_LOCAL_DI[6]),
    .Q2(Z80_LOCAL_DI[1]), .Q8(Z80_LOCAL_DI[7]), .Q4(Z80_LOCAL_DI[3]), .Q5(Z80_LOCAL_DI[4]),
    .Q1(Z80_LOCAL_DI[0]));
  not inst267 (inst267_out, FPGA_OUT_A15);
  not inst15 (USB_TX_BUSY_LED, UART_Busy);
  not inst329 (inst329_out, ROM_A12);
  or inst9 (\FPGA_OUT_LOW_ROM_LED- , DISABLE_ALL_ROM, ROM_A12);
  nor inst19 (\BOARD_WAIT- , inst103_qhn, inst121_qhn, inst121_qhn);
  not inst270 (\FPGA_OUT_HIGH_RAM_LED- , inst266_q);
  and inst268 (FPGA_OUT_RAM_A16, inst266_q, inst267_out);
  or inst14 (\FPGA_OUT_HIGH_ROM_LED- , DISABLE_ALL_ROM, inst329_out);
  DFF inst292 (.CLRN(1'b1), .CLK(OUT_CPU_CLK), .D(\FPGA_IN_pHOLD- ), .PRN(1'b1), .Q(\Z80_BUSRQ- ));
  not inst113 (FPGA_OUT_pHLDA, \Z80_BUSAK- );
  or inst310 (ROM_ADDRESS[0], FPGA_OUT_A0, FPGA_OUT_A0);
  or inst309 (ROM_ADDRESS[1], FPGA_OUT_A1, FPGA_OUT_A1);
  or inst308 (ROM_ADDRESS[2], FPGA_OUT_A2, FPGA_OUT_A2);
  or inst307 (ROM_ADDRESS[3], FPGA_OUT_A3, FPGA_OUT_A3);
  or inst306 (ROM_ADDRESS[4], FPGA_OUT_A4, FPGA_OUT_A4);
  or inst305 (ROM_ADDRESS[5], FPGA_OUT_A5, FPGA_OUT_A5);
  or inst316 (ROM_ADDRESS[6], FPGA_OUT_A6, FPGA_OUT_A6);
  DFF inst97 (.CLRN(inst29_out), .CLK(inst118_out), .D(inst29_out), .PRN(1'b1), .Q(inst97_q));
  not inst241 (IN_BOARD_RESET, \FPGA_IN_BOARD_RESET- );
  DFF inst108 (.CLRN(FPGA_OUT_pHLDA), .CLK(FPGA_OUT_CPU_CLK), .D(FPGA_OUT_pHLDA), .PRN(1'b1), .Q(inst108_q));
  DLATCH inst158[7:0] (
    .CLRN(\FPGA_IN_BOARD_RESET- ), .D(Z80_LOCAL_D0), .ENA(USB_DATA_OUT), .PRN(1'b1), .Q(USB_DATA_OUT_BUS));
  not inst87 (\FPGA_OUT_CTL_OE- , \FPGA_IN_CDSB- );
  not inst88 (\FPGA_OUT_STATUS_OE- , \FPGA_IN_SDSB- );
  not inst100 (\FPGA_ADD_OE- , \FPGA_IN_SDSB- );
  not inst101 (\FPGA_OUT_DO_OE- , \FPGA_IN_SDSB- );
  not inst107 (\FPGA_OUT_DI_OE- , \FPGA_IN_SDSB- );
  \74373b  inst280 (.D(Z80_ADDRESS[7:0]), .G(ADDRESS_LATCH), .OEN(inst281_out), .Q(LOCAL_ADDRESS_BUS[7:0]));
  \74373b  inst282 (.D(Z80_ADDRESS[15:8]), .G(ADDRESS_LATCH), .OEN(inst283_out), .Q(LOCAL_ADDRESS_BUS[15:8]));
  not inst291 (inst291_out, inst108_q);
  not inst187 (inst187_out, FPGA_OUT_sOUT);
  nor inst109 (inst109_out, \FPGA_IN_pHOLD- , inst291_out);
  or inst315 (ROM_ADDRESS[7], FPGA_OUT_A7, FPGA_OUT_A7);
  or inst314 (ROM_ADDRESS[8], FPGA_OUT_A8, FPGA_OUT_A8);
  or inst313 (ROM_ADDRESS[9], FPGA_OUT_A9, FPGA_OUT_A9);
  or inst312 (ROM_ADDRESS[10], FPGA_OUT_A10, FPGA_OUT_A10);
  or inst311 (ROM_ADDRESS[11], FPGA_OUT_A11, FPGA_OUT_A11);
  or inst317 (ROM_ADDRESS[12], ROM_A12, ROM_A12);
  nor inst218 (inst218_out, \FPGA_OUT_pWR- , inst187_out, \PORT_6- );
  not inst281 (inst281_out, \FPGA_IN_SDSB- );
  not inst283 (inst283_out, \FPGA_IN_SDSB- );
  TRI inst137 (.IN(FPGA_BI_D3), .OE(READ_RAM), .OUT(Z80_LOCAL_DI[3]));
  TRI inst136 (.IN(FPGA_OUT_DO3), .OE(WRITE_RAM), .OUT(FPGA_BI_D3));
  DFF inst102 (.CLRN(1'b1), .CLK(OUT_CPU_CLK), .D(inst109_out), .PRN(1'b1), .Q(inst102_q));
  TRI inst156 (.IN(FPGA_BI_D7), .OE(READ_RAM), .OUT(Z80_LOCAL_DI[7]));
  TRI inst155 (.IN(FPGA_OUT_DO7), .OE(WRITE_RAM), .OUT(FPGA_BI_D7));
  not inst86 (inst86_out, \FPGA_IN_CDSB- );
  not inst110 (FPGA_OUT_CTL_DISABLE, inst102_q);
  \74244  inst71 (
    .\1A2 (pSYNC_RAW), .\1A4 (inst81_out), .\1A1 (inst97_q), .\1A3 (ADDRESS_LATCH), .\1GN (inst86_out),
    .\2A3 (inst83_out), .\2GN (\F_BOARD_ACTIVE- ), .\2A1 (OUT_CPU_CLK), .\2A4 (\FPGA_IN_INT- ),
    .\2A2 (\2mHz ), .\1Y2 (FPGA_OUT_pSYNC), .\1Y4 (\FPGA_OUT_pWR- ), .\2Y1 (FPGA_OUT_PHI),
    .\1Y1 (FPGA_OUT_pDBIN), .\2Y3 (FPGA_OUT_MWRT), .\2Y4 (inst71_2y4), .\1Y3 (\FPGA_OUT_pSTVAL- ),
    .\2Y2 (FPGA_OUT_2mHz_CLOCK));
  nor inst83 (inst83_out, IO_OUTPUT, inst81_out);
  DLATCH inst182 (.CLRN(\FPGA_IN_BOARD_RESET- ), .D(Z80_LOCAL_D0[0]), .ENA(inst218_out), .PRN(1'b1), .Q(inst182_q));
  DLATCH inst183 (.CLRN(\FPGA_IN_BOARD_RESET- ), .D(Z80_LOCAL_D0[1]), .ENA(inst218_out), .PRN(1'b1), .Q(inst183_q));
  DLATCH inst184 (.CLRN(\FPGA_IN_BOARD_RESET- ), .D(Z80_LOCAL_D0[2]), .ENA(inst218_out), .PRN(1'b1), .Q(inst184_q));
  DLATCH inst185 (.CLRN(\FPGA_IN_BOARD_RESET- ), .D(Z80_LOCAL_D0[3]), .ENA(inst218_out), .PRN(1'b1), .Q(inst185_q));
  DLATCH inst186 (.CLRN(\FPGA_IN_BOARD_RESET- ), .D(Z80_LOCAL_D0[4]), .ENA(inst218_out), .PRN(1'b1), .Q(inst186_q));
  DLATCH inst188 (.CLRN(\FPGA_IN_BOARD_RESET- ), .D(Z80_LOCAL_D0[5]), .ENA(inst218_out), .PRN(1'b1), .Q(inst188_q));
  DLATCH inst208 (.CLRN(\FPGA_IN_BOARD_RESET- ), .D(Z80_LOCAL_D0[6]), .ENA(inst218_out), .PRN(1'b1), .Q(inst208_q));
  DLATCH inst209 (.CLRN(\FPGA_IN_BOARD_RESET- ), .D(Z80_LOCAL_D0[7]), .ENA(inst218_out), .PRN(1'b1), .Q(inst209_q));
  not inst112 (FPGA_OUT_STATUS_DISABLE, inst108_q);
  not inst191 (inst191_out, FPGA_OUT_pDBIN);
  not inst212 (F_BAR0, inst182_q);
  not inst214 (F_BAR1, inst183_q);
  not inst215 (F_BAR2, inst184_q);
  nor inst205 (USB_STATUS_IN, inst191_out, \USB_STATUS- );
  not inst216 (F_BAR3, inst185_q);
  not inst219 (F_BAR4, inst186_q);
  not inst221 (F_BAR5, inst188_q);
  not inst220 (F_BAR6, inst208_q);
  not inst222 (F_BAR7, inst209_q);
  not inst206 (\USB_STATUS_IN- , USB_STATUS_IN);
  DLATCH inst194 (.CLRN(\FPGA_IN_BOARD_RESET- ), .D(UART_DATA_READY), .ENA(USB_STATUS_IN), .PRN(1'b1), .Q(inst194_q));
  DLATCH inst195 (.CLRN(\FPGA_IN_BOARD_RESET- ), .D(UART_Busy), .ENA(USB_STATUS_IN), .PRN(1'b1), .Q(inst195_q));
  DLATCH inst196 (
    .CLRN(\FPGA_IN_BOARD_RESET- ), .D(UART_Byte_Recieved), .ENA(USB_STATUS_IN), .PRN(1'b1), .Q(inst196_q));
  DLATCH inst197 (
    .CLRN(\FPGA_IN_BOARD_RESET- ), .D(UART_Busy_Recieving), .ENA(USB_STATUS_IN), .PRN(1'b1), .Q(inst197_q));
  DLATCH inst198 (.CLRN(\FPGA_IN_BOARD_RESET- ), .D(1'b0), .ENA(USB_STATUS_IN), .PRN(1'b1), .Q(inst198_q));
  DLATCH inst199 (.CLRN(\FPGA_IN_BOARD_RESET- ), .D(1'b0), .ENA(USB_STATUS_IN), .PRN(1'b1), .Q(inst199_q));
  DLATCH inst200 (.CLRN(\FPGA_IN_BOARD_RESET- ), .D(1'b0), .ENA(USB_STATUS_IN), .PRN(1'b1), .Q(inst200_q));
  DLATCH inst201 (.CLRN(\FPGA_IN_BOARD_RESET- ), .D(UART_Error), .ENA(USB_STATUS_IN), .PRN(1'b1), .Q(inst201_q));
  \74244  inst252 (
    .\1A2 (inst183_q), .\1A4 (inst185_q), .\1A1 (inst182_q), .\1A3 (inst184_q), .\1GN (\BAR_IN_ENABLE- ),
    .\2A3 (inst208_q), .\2GN (\BAR_IN_ENABLE- ), .\2A1 (inst186_q), .\2A4 (inst209_q), .\2A2 (inst188_q),
    .\1Y2 (Z80_LOCAL_DI[1]), .\1Y4 (Z80_LOCAL_DI[3]), .\2Y1 (Z80_LOCAL_DI[4]), .\1Y1 (Z80_LOCAL_DI[0]),
    .\2Y3 (Z80_LOCAL_DI[6]), .\2Y4 (Z80_LOCAL_DI[7]), .\1Y3 (Z80_LOCAL_DI[2]), .\2Y2 (Z80_LOCAL_DI[5]));
  not inst254 (inst254_out, \PORT_6- );
  nand inst256 (\BAR_IN_ENABLE- , FPGA_OUT_pDBIN, FPGA_OUT_sINP, inst254_out);
  \74244  inst255 (
    .\1A2 (inst195_q), .\1A4 (inst197_q), .\1A1 (inst194_q), .\1A3 (inst196_q), .\1GN (\USB_STATUS_IN- ),
    .\2A3 (inst200_q), .\2GN (\USB_STATUS_IN- ), .\2A1 (inst198_q), .\2A4 (inst201_q), .\2A2 (inst199_q),
    .\1Y2 (Z80_LOCAL_DI[1]), .\1Y4 (Z80_LOCAL_DI[3]), .\2Y1 (Z80_LOCAL_DI[4]), .\1Y1 (Z80_LOCAL_DI[0]),
    .\2Y3 (Z80_LOCAL_DI[6]), .\2Y4 (Z80_LOCAL_DI[7]), .\1Y3 (Z80_LOCAL_DI[2]), .\2Y2 (Z80_LOCAL_DI[5]));

  assign FPGA_OUT_RAM_A17 = 1'b0;
  assign FPGA_OUT_RAM_A18 = 1'b0;
  assign \FPGA_OUT_RAM_CS-  = 1'b0;

  // Other names for the same wires on the sheet: 50mHz = CLK_50; DATA_FROM_USB_PORT = USB_RX;
  //   DATA_OUT_D0 = FPGA_OUT_DO0; DATA_OUT_D1 = FPGA_OUT_DO1; DATA_OUT_D2 = FPGA_OUT_DO2; DATA_OUT_D3 = FPGA_OUT_DO3;
  //   DATA_OUT_D4 = FPGA_OUT_DO4; DATA_OUT_D5 = FPGA_OUT_DO5; DATA_OUT_D6 = FPGA_OUT_DO6; DATA_OUT_D7 = FPGA_OUT_DO7;
  //   OUT_sINP = FPGA_OUT_sINP; OUT_sMEMR = FPGA_OUT_sMEMR; OUT_sOUT = FPGA_OUT_sOUT; OUT_sWO- = \FPGA_OUT_sWO- ;
  //   IN_BOARD_RESET- = \FPGA_IN_BOARD_RESET- ; IN_CDSB- = \FPGA_IN_CDSB- ; IN_SDSB- = \FPGA_IN_SDSB- ;
  //   IOBYTE- = LED_4; OUT_CPU_CLK- = FPGA_OUT_CPU_CLK; OUT_MWRT = FPGA_OUT_MWRT; OUT_pDBIN = FPGA_OUT_pDBIN;
  //   OUT_pWR- = \FPGA_OUT_pWR- ; OUT_RAM_WRITE- = \FPGA_OUT_RAM_WR- ; OUT_sHLTA = FPGA_OUT_sHLTA;
  //   OUT_sINTA = FPGA_OUT_sINTA; OUT_sM1 = FPGA_OUT_sM1; S100_A0 = FPGA_OUT_A0; S100_A1 = FPGA_OUT_A1;
  //   S100_A2 = FPGA_OUT_A2; S100_A3 = FPGA_OUT_A3; S100_A4 = FPGA_OUT_A4; S100_A5 = FPGA_OUT_A5;
  //   S100_A6 = FPGA_OUT_A6; S100_A7 = FPGA_OUT_A7; S100_A8 = FPGA_OUT_A8; S100_A9 = FPGA_OUT_A9;
  //   S100_A10 = FPGA_OUT_A10; S100_A11 = FPGA_OUT_A11; S100_A12 = FPGA_OUT_A12; S100_A13 = FPGA_OUT_A13;
  //   S100_A14 = FPGA_OUT_A14; S100_A15 = FPGA_OUT_A15; S100_A16 = FPGA_OUT_A16; S100_A17 = FPGA_OUT_A17;
  //   S100_A18 = FPGA_OUT_A18; S100_A19 = FPGA_OUT_A19; SERIAL_DATA_TO_USB_PORT = USB_TX

  // Notes on the sheet:
  //   NOTES:
  //   Signal names with a '-' at the end are ACTIVE LOW Signals on the S100 Bus. (e.g. F_pWR-).
  //   Remember default input pins are read as HIGH
  //   All FPGA IN/OUT Pins begin with FPGA_
  //   IN_ ,OUT_, referr to signal comming into the FPGA or from it.
  //   LOW to Inactivate Ctrl  lines (Normally HIGH)
  //   LOW to Inactivate Addres, Status & data  lines (Normally HIGH)
  //   All Normaly LOW
  //   CAN LEAVE ACTIVE ALL THE TIME
  //   SO SMB SHOWS DATA ON BUS
  //   CAN LEAVE ACTIVE ALL THE TIME
  //   FPGA CODE WILL HANDLE THINGS
  //   U16
  //   HIGH ADDRESS LINES ZERO FOR PORTS
  //   U15
  //   U14
  //   For now just 64K
  //   BUS REQUEST
  //   U8
  //   U17
  //   BUS ACK
  //   INTA
  //   BUS IN
  //   U10
  //   READ STROBE
  //   Later modify for
  //   Master/Slave
  //   DATA FROM CPU
  //   INPUT FROM ANY S100 BUS PORT (Excluding local board ports)
  //   DATA TO CPU
  //    READ FROM RAM
  //    READ FROM RAM
  //    READ FROM RAM
  //    READ FROM RAM
  //    WRITE TO  RAM
  //    WRITE TO  RAM
  //    WRITE TO  RAM
  //    WRITE TO  RAM
  //   READ_RAM
  //   READ_RAM
  //   READ_RAM
  //    READ FROM RAM
  //    READ FROM RAM
  //    READ FROM RAM
  //    READ FROM RAM
  //    WRITE TO  RAM
  //    WRITE TO  RAM
  //    WRITE TO  RAM
  //    WRITE TO  RAM
  //   ADDRESS F000 - FFFFH
  //   Currently configured for 8K (F000-FFFFH)
  //   can be 4,8 or 16K
  //   ROM_A12 TO SET LOW/HIGH PAGE OF ROM @ F000H
  //   High
  //   HIGH FOR READ
  //   OUT_RAM_READ-
  //   OUT_RAM_READ-
  //   High
  //   OUT_RAM_WRITE-
  //   OUT_RAM_WRITE-
  //   High
  //   HIGH FOR WRITE
  //   ROM F000-FFFFH
  //   HIGH for 0000H-EFFFH
  //   Until the FIRST time the ROM is addressed
  //   Note until the NEXT reset,  JMP_ENABLE 
  //   will never be reactivated.  Will always be LOW
  //   High
  //   Extra RAM not yet utilized
  //   IO Wait States
  //   NO ROM Wait states for now
  //   IOBYTE PORT (LOCAL, 36H)
  //   PORT 30-37H
  //   30H
  //   31H
  //   32H
  //   33H
  //   34H
  //   35H
  //   Block S100 Bus Inputs
  //   36H
  //   Port IN
  //   Port OUT
  //   37H
  //   Clock LOW->HIGH
  //   Data Latched
  //   Clock LOW->HIGH
  //   ---->
  //   This bit must be LOW before transmitting the next character
  //    READ FROM RAM
  //   Clock LOW->HIGH
  //   Diagnostic Port (LEDS) 06H
  //   PORT0-7H
  //   Data Latched
  //   Clock LOW->HIGH
  //    Printer Strobe
  //   Printer Status & Data
  //   Normally LOW
  //   OUT 07H, 02H  disables onboard ROM (LOW for ROM to be active, HIGH to remove ROM)
  //   07H
  //   ALLOW READING BY CPU OF LED's (Port 6)
  //   Normally LOW
  //   OUT 07H , 01H raises A12 of FPGA ROM  (HIGH page of ROM is activeated)
  //   07H
endmodule
